# EAGLE design SOICtoDIPAdapter (EAGLE 7.4.0)
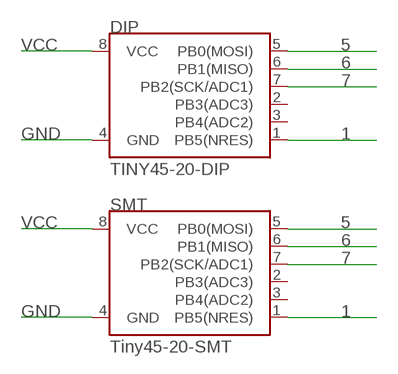
[diagram p0: schematic, sheet 1]

## Parts
DIP  TINY45-20-DIP  ATTINY45TINY45-20-DIP  [DIP08]
SMT  Tiny45-20-SMT  ATTINY45TINY45-20-SMT  [SO08-EIAJ]

## Nets
1: DIP.1(PB5(NRES)) SMT.1(PB5(NRES))
5: DIP.5(PB0(MOSI)) SMT.5(PB0(MOSI))
6: DIP.6(PB1(MISO)) SMT.6(PB1(MISO))
7: DIP.7(PB2(SCK/ADC1)) SMT.7(PB2(SCK/ADC1))
GND: DIP.4(GND) SMT.4(GND)
VCC: DIP.8(VCC) SMT.8(VCC)
Unconnected: DIP.2(PB3(ADC3)) DIP.3(PB4(ADC2)) SMT.2(PB3(ADC3)) SMT.3(PB4(ADC2))

## Library data of the parts
DIP = SparkFun-DigitalIC:ATTINY45: Atmel 8-pin 2/4/8kB flash uC; PROD_ID: IC-09439
SMT = SparkFun-DigitalIC:ATTINY45: Atmel 8-pin 2/4/8kB flash uC; PROD_ID: IC-08922

## Board
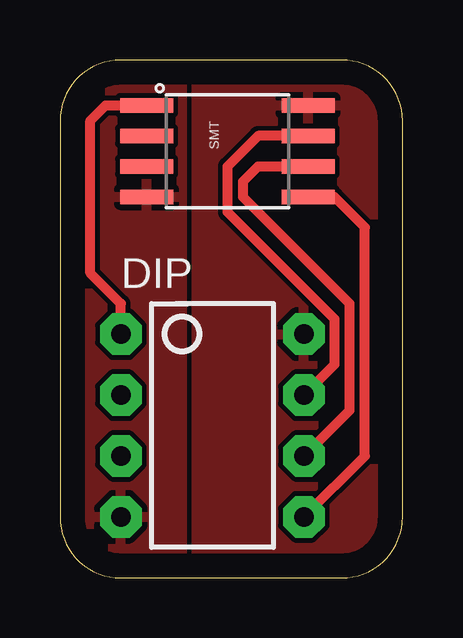
[diagram p1: board, top side]

Size 14.28 x 21.58 mm. Coordinates in mm from the lower left corner, seen from the top.
Outline: 0,19.04 0,2.54 arc90 2.54,0 11.73,0 arc90 14.28,2.54 14.28,19.04 arc90 11.73,21.58 2.54,21.58 arc90 0,19.04
Copper layers (1*16): Top 0.035mm / dielectric 1.5mm / Bottom 0.035mm
Design rules "default": minimum track width 10mil, minimum drill 24mil, track to track 8mil, track to pad 8mil, pad to pad 8mil, via to via 8mil, smd to smd 8mil, copper to edge 40mil, drill to drill 8mil, minimum pad ring 10mil, minimum via ring 8mil, stop-mask expansion 4mil, vias tented up to drill 0mil, thermal gap 10mil

### Footprints (pad centres in the part's own frame; a part is rotated, then mirrored left to right if it is on the bottom)
DIP08 = drill 0.813 pad 1.727 octagon: 1 -3.81,-3.81; 2 -1.27,-3.81; 3 1.27,-3.81; 4 3.81,-3.81; 5 3.81,3.81; 6 1.27,3.81; 7 -1.27,3.81; 8 -3.81,3.81
SO08-EIAJ = smd 0.61 x 2.21: 1 -1.905,-3.378; 2 -0.635,-3.378; 3 0.635,-3.378; 4 1.905,-3.378; 5 1.905,3.353; 6 0.635,3.353; 7 -0.635,3.353; 8 -1.905,3.353

### Placement (x,y rotation side)
DIP  6.35,6.35 270 top
SMT  6.99,17.78 270 top

### Tracks (layer width: path | path; a pad name or v marks a point on that pad's centre or on a via)
1
  Top 0.406: DIP.1 2.54,11.43 1.27,12.7 1.27,19.05 1.91,19.68 SMT.1
5
  Top 0.406: DIP.5 12.7,5.08 12.7,14.61 11.43,15.88 SMT.5
6
  Top 0.406: SMT.6 8.26,17.14 7.62,16.51 7.62,15.88 12.06,11.43 12.06,6.99 DIP.6
7
  Top 0.406: SMT.7 8.26,18.41 6.99,17.14 6.99,15.24 11.43,10.79 11.43,8.89 DIP.7
GND
  pour Top: -2.54,25.4 5.08,25.4 5.08,-3.81 -2.54,-3.81
VCC
  pour Top (rank 2): 5.08,25.4 5.08,-3.81 15.24,-3.81 15.24,25.4